# Altium project RCB_WiWi_STM32WL3.PrjPcb (part 1 of 2)
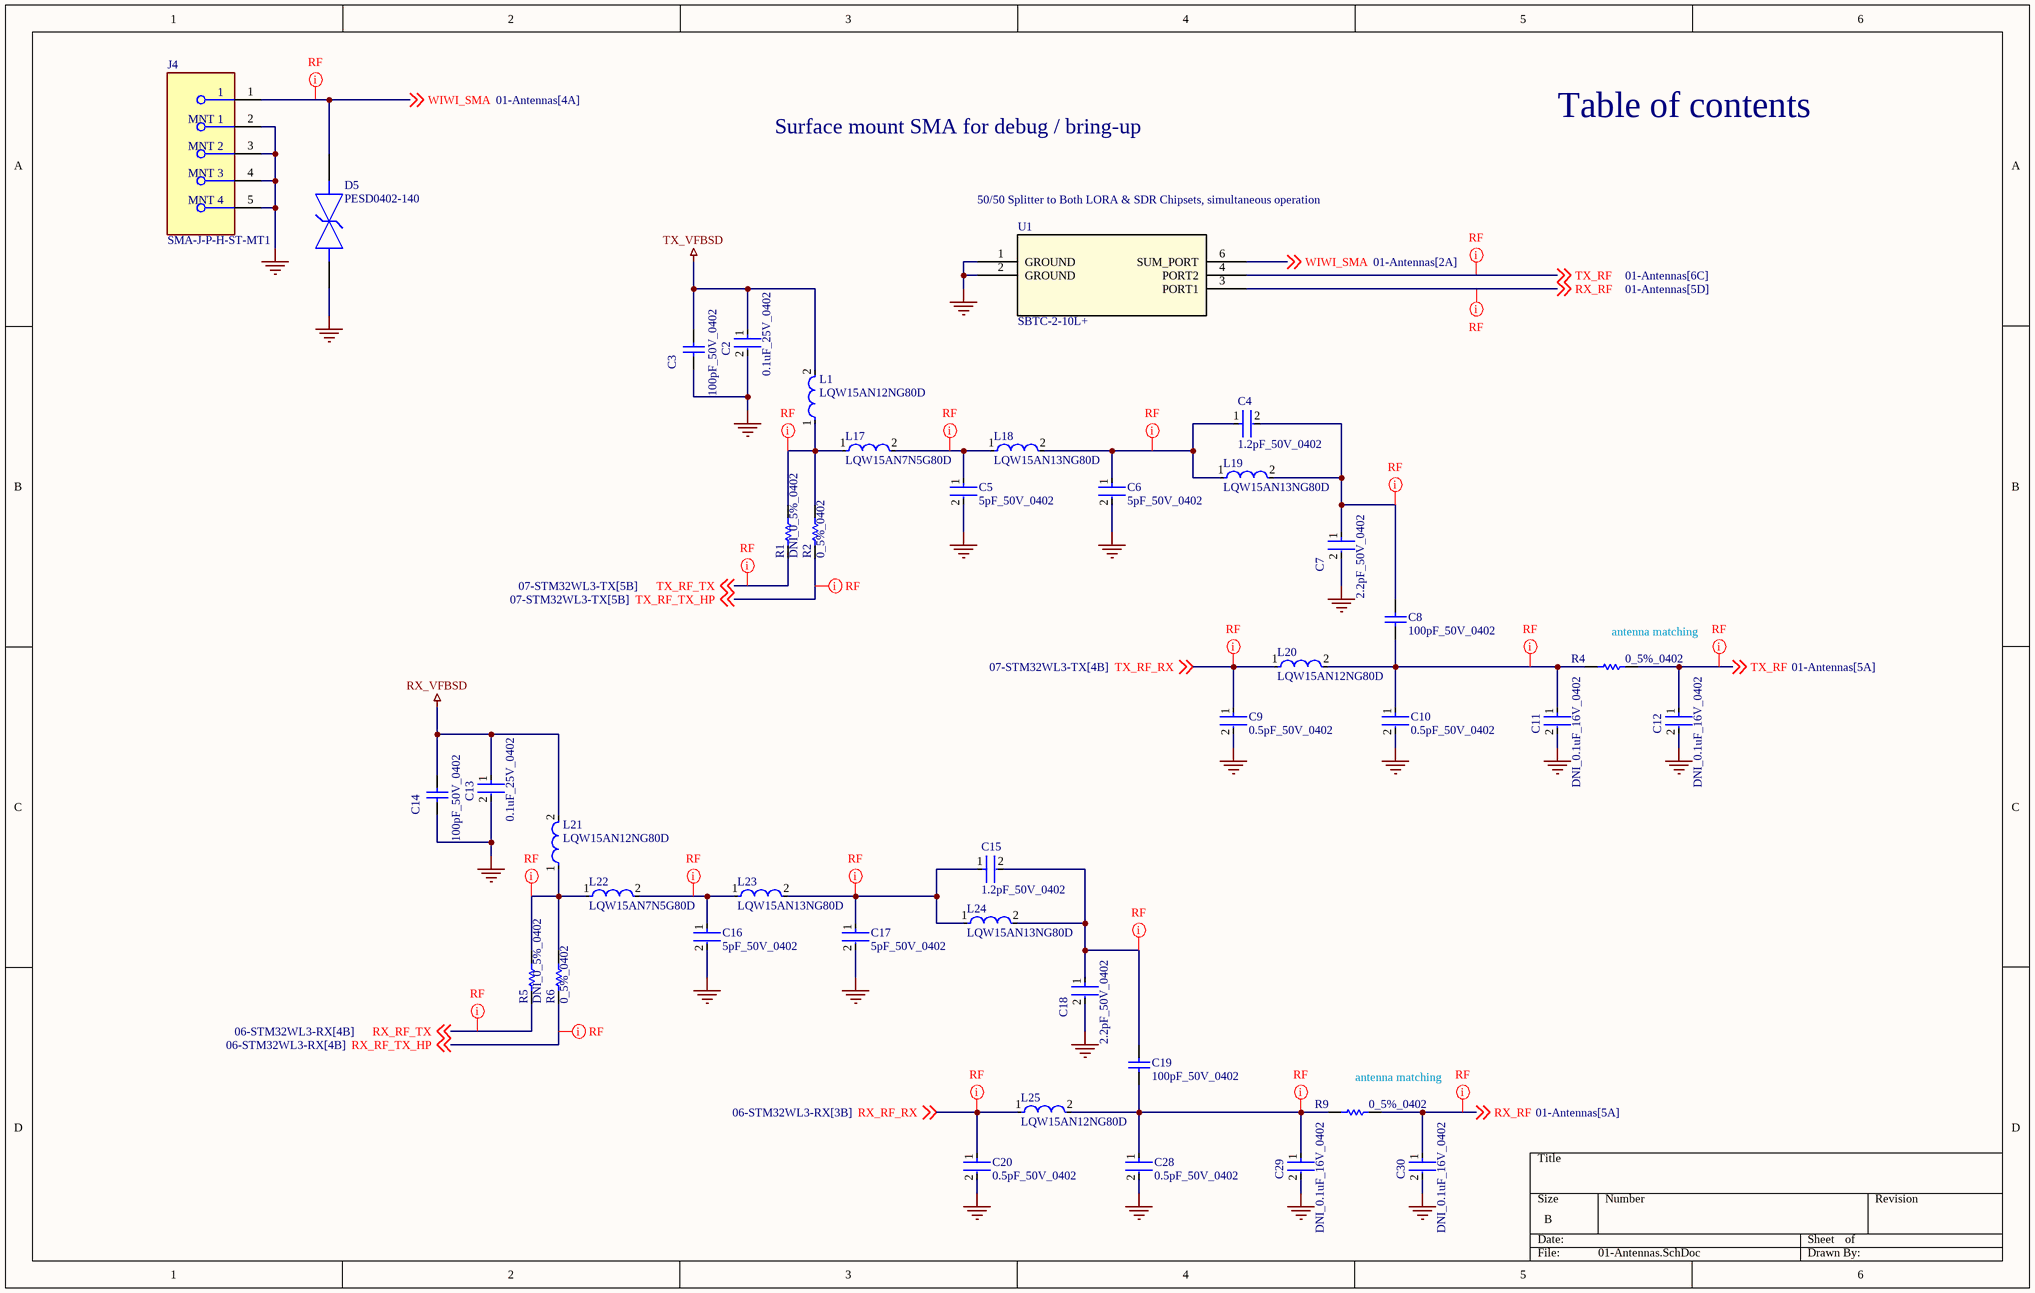
[diagram p0: 01-Antennas.SchDoc]
prjCompanyName: Meta Platforms Technologies, LLC.; prjContactAddress1: 9845 Willows Road NE; prjContactAddress2: Redmond, WA 98052; prjContactEmail: Contact Email; prjContactPhone: (...)-...-....; prjElectricalEngineer: Electical Engineer; prjElectricalEngineerEmail: Electical Engineer Email; prjLayoutEngineer: Layout Engineer; prjLayoutEngineerEmail: Layout Engineer Email; prjMechanicalEngineer: Mechanical Engineer; prjMechanicalEngineerEmail: Mechanical Engineer Email; prjPCB_IPN: 844-XXXXX-XX; prjPCB_Name: PCB Name; prjPCB_Revision: X1; prjProjectName: Project Name; prjSchematic_IPN: 846-XXXXX-XX; prjSchematic_Revision: X1; XprjPCBA_IPN: Set v_prjPCBA_IPN in variant parameters; XprjPCBA_Revision: Set v_prjPCBA_Revision in variant parameters
5 sheets, 223 parts. Net scope: global (net labels, ports and power ports of the same name join across sheets).
Board file: RCB_WiWi_STM32WL3_V1.PcbDoc
Sheets:
  01-Antennas.SchDoc
  02-8A34004_DPLL-1.SchDoc
  05-USB-Prog.SchDoc
  06-STM32WL3-RX.SchDoc
  07-STM32WL3-TX.SchDoc

## Sheet 01-Antennas.SchDoc
size B; SheetNumber: 1; SheetTotal: 8; SPICEModelCacheELOCFEDZ: <root> / <DocumentId>ELOCFEDZ</DocumentId> / </root>

### Parts
C2  0.1uF_25V_0402  [FP-0402-L_1_0_1-W_0_5_0_1-IPC_C]
C3  100pF_50V_0402  [CAPC1005X55X25ML05T10]
C4  1.2pF_50V_0402  [FP-GJM155-0_05-IPC_A]
C5  5pF_50V_0402  [FP-GJM155-0_05-IPC_B]
C6  5pF_50V_0402  [FP-GJM155-0_05-IPC_B]
C7  2.2pF_50V_0402  [FP-GJM155-0_05-IPC_C]
C8  100pF_50V_0402  [CAPC1005X55X25ML05T10]
C9  0.5pF_50V_0402  [FP-GJM155-0_05-MFG]
C10  0.5pF_50V_0402  [FP-GJM155-0_05-MFG]
C11  DNI_0.1uF_16V_0402  [FP-C0402-BB-MFG]  (no BOM)
C12  DNI_0.1uF_16V_0402  [FP-C0402-BB-MFG]  (no BOM)
C13  0.1uF_25V_0402  [FP-0402-L_1_0_1-W_0_5_0_1-IPC_C]
C14  100pF_50V_0402  [CAPC1005X55X25ML05T10]
C15  1.2pF_50V_0402  [FP-GJM155-0_05-IPC_A]
C16  5pF_50V_0402  [FP-GJM155-0_05-IPC_B]
C17  5pF_50V_0402  [FP-GJM155-0_05-IPC_B]
C18  2.2pF_50V_0402  [FP-GJM155-0_05-IPC_C]
C19  100pF_50V_0402  [CAPC1005X55X25ML05T10]
C20  0.5pF_50V_0402  [FP-GJM155-0_05-MFG]
C28  0.5pF_50V_0402  [FP-GJM155-0_05-MFG]
C29  DNI_0.1uF_16V_0402  [FP-C0402-BB-MFG]  (no BOM)
C30  DNI_0.1uF_16V_0402  [FP-C0402-BB-MFG]  (no BOM)
D5  PESD0402-140  [FP-PESD0402-MFG]
J4  SMA-J-P-H-ST-MT1  [FP-SMA-J-P-H-ST-MT1-MFG]
L1  LQW15AN12NG80D  [FP-LQW15AN_80-MFG]
L17  LQW15AN7N5G80D  [FP-LQW15AN_80-MFG]
L18  LQW15AN13NG80D  [FP-LQW15AN_80-MFG]
L19  LQW15AN13NG80D  [FP-LQW15AN_80-MFG]
L20  LQW15AN12NG80D  [FP-LQW15AN_80-MFG]
L21  LQW15AN12NG80D  [FP-LQW15AN_80-MFG]
L22  LQW15AN7N5G80D  [FP-LQW15AN_80-MFG]
L23  LQW15AN13NG80D  [FP-LQW15AN_80-MFG]
L24  LQW15AN13NG80D  [FP-LQW15AN_80-MFG]
L25  LQW15AN12NG80D  [FP-LQW15AN_80-MFG]
R1  DNI_0_5%_0402  [RESC1005X40X25NL05T10]  (no BOM)
R2  0_5%_0402  [RESC1005X40X25NL05T10]
R4  0_5%_0402  [RESC1005X40X25NL05T10]
R5  DNI_0_5%_0402  [RESC1005X40X25NL05T10]  (no BOM)
R6  0_5%_0402  [RESC1005X40X25NL05T10]
R9  0_5%_0402  [RESC1005X40X25NL05T10]
U1  SBTC-2-10L+  [AT1029_MNC]

### Nets
GND: C2.2 C3.1 C5.2 C6.2 C7.2 C9.2 C10.2 C11.2 C12.2 C13.2 C14.1 C16.2 C17.2 C18.2 C20.2 C28.2 C29.2 C30.2 D5.1 J4.2(MNT_1) J4.3(MNT_2) J4.4(MNT_3) J4.5(MNT_4) U1.1(GROUND) U1.2(GROUND)
RX_VFBSD: C13.1 C14.2 L21.2
TX_VFBSD: C2.1 C3.2 L1.2
RX_RF: C30.1 R9.2 U1.3(PORT1) ; off-sheet RX_RF
RX_RF_RX: C20.1 L25.1 ; off-sheet RX_RF_RX
RX_RF_TX: R5.1 ; off-sheet RX_RF_TX
RX_RF_TX_HP: R6.1 ; off-sheet RX_RF_TX_HP
TX_RF: C12.1 R4.2 U1.4(PORT2) ; off-sheet TX_RF
TX_RF_RX: C9.1 L20.1 ; off-sheet TX_RF_RX
TX_RF_TX: R1.1 ; off-sheet TX_RF_TX
TX_RF_TX_HP: R2.1 ; off-sheet TX_RF_TX_HP
WIWI_SMA: D5.2 J4.1 U1.6(SUM_PORT) ; off-sheet WIWI_SMA
NetC4_1: C4.1 C6.1 L18.2 L19.1
NetC4_2: C4.2 C7.1 C8.2 L19.2
NetC5_1: C5.1 L17.2 L18.1
NetC8_1: C8.1 C10.1 C11.1 L20.2 R4.1
NetC15_1: C15.1 C17.1 L23.2 L24.1
NetC15_2: C15.2 C18.1 C19.2 L24.2
NetC16_1: C16.1 L22.2 L23.1
NetC19_1: C19.1 C28.1 C29.1 L25.2 R9.1
NetL1_1: L1.1 L17.1 R1.2 R2.2
NetL21_1: L21.1 L22.1 R5.2 R6.2

### Layout directives
net class RF: NetC4_1, NetC4_2, NetC5_1, NetC8_1, NetC15_1, NetC15_2, NetC16_1, NetC19_1, NetL1_1, NetL21_1, RX_RF, RX_RF_RX, RX_RF_TX, RX_RF_TX_HP, TX_RF, TX_RF_RX, TX_RF_TX, TX_RF_TX_HP, WIWI_SMA

### Notes on the sheet
- Surface mount SMA for debug / bring-up
- Table of contents
- 50/50 Splitter to Both LORA & SDR Chipsets, simultaneous operation
- (near R4) antenna matching
- (near R9) antenna matching

### Library data of the parts
C2 C13 = CMP-2008-02519-2: General Purpose Ceramic Capacitor, 0402, 100nF, 10%, X7R, 15%, 25V; Package Quantity: 1; Capacitance: 100nF; Min Operating Temperature: -55°C; Voltage: 25V; Voltage Rating: 25V; Construction: Flat; Max Operating Temperature: 125°C; Radiation Hardening: No; Depth: 0.5mm; Thickness: 0.022inch; Voltage Rating (DC): 25V; Number of Pins: 2; Lead Free: Lead Free; Series: -; REACH SVHC: No SVHC; Length: 1mm; Dielectric: X7R; RoHS Compliant: Yes; Mount: Surface Mount; Packaging: Tape and Reel; Case/Package: 0402; Case Code (Imperial): 0402; Termination: SMD/SMT; Width: 0.02inch; Case Code (Metric): 1005; Tolerance: 10%
C3 C8 C14 C19 = CMP-2008-03915-1: Manufacturer: Murata; Part Number: GRM1555C1H101JA01D
C4 C15 = CMP-2008-03815-2: Multi-Layer Ceramic Capacitor 1.2pF C0G  ±0.05pF 0402 Paper T/R; Voltage Rating: 50V; Min Operating Temperature: -55°C; Length: 1mm; Package Quantity: 10000; Depth: 0.5mm; Radiation Hardening: No; Case/Package: 0402; Mount: Surface Mount; Dielectric: C0G; Case Code (Metric): 1005; Case Code (Imperial): 0402; Height: 0.5mm; Packaging: Tape and Reel; Width: 0.02inch; Voltage Rating (DC): 50V; Capacitance: 1.2pF; Lead Free: Lead Free; Termination: SMD/SMT; Voltage: 50V; Max Operating Temperature: 125°C; Thickness: 0.022inch
C5 C6 C16 C17 = CMP-06035-005630-1: Multi-Layer Ceramic Capacitor 5pF C0G  ±0.05pF 0402 Paper T/R; Voltage Rating (DC): 50V; Capacitance: 5pF; Case Code (Metric): 1005; Radiation Hardening: No; Package Quantity: 10000; Case Code (Imperial): 0402; Termination: SMD/SMT; Min Operating Temperature: -55°C; Depth: 0.5mm; Packaging: Tape and Reel; Length: 1mm; Dielectric: C0G; Width: 0.5mm; Height: 0.5mm; Case/Package: 0402; Thickness: 0.022inch; Max Operating Temperature: 125°C; Voltage Rating: 50V; Mount: Surface Mount
C7 C18 = CMP-2008-03837-2: Multi-Layer Ceramic Capacitor 2.2pF C0G  ±0.05pF 0402 Paper T/R; Voltage Rating: 50V; Case/Package: 0402; Termination: SMD/SMT; Package Quantity: 10000; Construction: Flat; Width: 0.02inch; Length: 0.039inch; Dielectric: C0G; Mount: Surface Mount; Radiation Hardening: No; Case Code (Imperial): 0402; Depth: 0.5mm; Case Code (Metric): 1005; Packaging: Tape and Reel; Height: 0.5mm; Series: GJM; Thickness: 0.022inch; Max Operating Temperature: 125°C; Lead Free: Lead Free; Min Operating Temperature: -55°C; Voltage Rating (DC): 50V; Capacitance: 2.2pF
C9 C10 C20 C28 = CMP-2008-03904-2: Multi-Layer Ceramic Capacitor 0.5pF C0G  ±0.1pF 0402 Paper T/R; Voltage Rating (DC): 50V; Temperature Coefficient: 30ppm/°C; Lead Pitch: 0.3mm; Max Operating Temperature: 125°C; Thickness: 0.022inch; Termination: SMD/SMT; Depth: 0.5mm; Height: 0.5mm; Voltage Rating: 50V; Length: 1mm; Case/Package: 0402; Radiation Hardening: No; Min Operating Temperature: -55°C; Width: 0.02inch; Voltage: 50V; Number of Pins: 2; REACH SVHC: No SVHC; Case Code (Imperial): 0402; Package Quantity: 1; Mount: Surface Mount; Capacitance: 0.5pF; Dielectric: C0G; Lead Free: Lead Free; Case Code (Metric): 1005; Packaging: Tape and Reel
C11 C12 C29 C30 = CMP-1034-02068-3: CAP CER 0.1UF 16V 5% X7R 0402; Manufacturer: Kemet; Manufacturer Part Number: C0402C104J4RACTU; Value: 0.10 μF; Temperature Coefficient: 15%; Tolerance: 0.05; Material: Ceramic; ComponentLink2URL: https://content.kemet.com/datasheets/KEM_C1002_X7R_SMD.pdf; Automotive: No; Device Class L2: Capacitors; Temperature: -55°C to +125°C; RoHS: TRUE; Voltage Rating: 16 V; ComponentLink2Description: Datasheet; Device Class L3: Ceramic Capacitors; Temperature Range Low: -55°C; Ipc Land Pattern Name: CAPC10050X50; Device Class L1: Passive Components; Temperature Range High: +125°C; Package: C0402-BB; Capacitance: 0.10 μF; Category: Cap; Mouser Description: CAP CER 0.1UF 16V X7R 0402; Height: 0.55mm; Digikey Description: CAP CER 0.1UF 16V 5% X7R 0402; Octopart: https://octopart.com/c0402c104j4ractu-kemet-12573893; Temperature Characteristic: X7R; Lead Free: Yes
D5 = CMP-08607-000011-1: TVS DIODE 14V 40V 0402; Manufacturer: Littelfuse Inc.; Automotive Grade: Grade 1; Capacitance: 0.25pF; Value: 0.25pF; Direction: Bidirectional; Number Of Channels: 1; Temperature Range Low: -55°C; Lead Free: Yes; Temperature: -55°C to +125°C; Digikey Description: TVS DIODE 14V 40V 0402; Automotive: Yes; Device Class L2: TVS Diodes; Reverse Standoff Voltage: 14V; Device Class L1: Circuit Protection; Ipc Land Pattern Name: DIOC10050X33; Manufacturer Part Number: PESD0402-140; Breakdown Voltage: 14V; Height: 0.43mm; Clamping Voltage: 40V; RoHS: TRUE; Temperature Range High: +125°C; Device Class L3: unset; Octopart: https://octopart.com/pesd0402-140-littelfuse-74215061; Package: PESD0402; ComponentLink2URL: https://www.littelfuse.com/~/media/electronics/datasheets/polymer_esd_suppressors/littelfuse_polymer_esd_suppressor_pesd_catalog_datasheet.pdf.pdf; Category: Diode; ComponentLink2Description: Datasheet
J4 = CMP-02754-000007-1: CONN SMA JACK STR 50 OHM SMD; Dielectric Material: PTFE; Voltage Rating: 335V; Body Material: Brass; Center Contact Plating: Gold; Impedance: 50R; Number of Ports: 1; Max Frequency: 20GHz; Mount: Surface Mount; Contact Plating: Gold; Housing Color: Gold; Series: -; Fastening Type: Threaded; Packaging: Bulk; Connector Type: SMA; Contact Material: Copper Alloy; Body Plating: Gold; Case/Package: SMA; Termination: Solder; RoHS Compliant: No; Min Operating Temperature: -65°C; Max Operating Temperature: 125°C
L1 L20 L21 L25 = CMP-06042-001817-1: Wire Wound RF Inductor 12nH ±2% 1240mA 0.093Ω 0402 (1005); Test Frequency: 100MHz; DC Resistance (DCR): 93mR; Self Resonant Frequency: 5.2GHz; Shielding: Unshielded; Max DC Current: 1.24A; Q Factor: 30; Core Material: Ferrite; Package Quantity: 10000; Case Code (Imperial): 0402; Inductance: 12nH; Packaging: Tape and Reel; Min Operating Temperature: -55°C; Mount: Surface Mount; Length: 0.039inch; Height: 0.5mm; Max Operating Temperature: 125°C; Case Code (Metric): 1005; Resistor Type: Wirewound; Height - Seated (Max): 0.024inch; Termination: SMD/SMT; Tolerance: 2%; Current Rating: 1.24A; Width: 0.024inch; Case/Package: 0402
L17 L22 = CMP-06042-000856-1: Wire Wound RF Inductor 7.5nH ±2% 1700mA 0.05Ω 0402 (1005); Max DC Current: 1.7A; Shielding: Unshielded; Core Material: Ferrite; Self Resonant Frequency: 7GHz; DC Resistance (DCR): 50mR; Test Frequency: 100MHz; Q Factor: 35; Inductance: 7.5nH; Mount: Surface Mount; Length: 0.039inch; Width: 0.024inch; Case Code (Metric): 0402; Min Operating Temperature: -55°C; Current Rating: 1.7A; Package Quantity: 10000; Tolerance: 2%; Height: 0.5mm; Case/Package: 0402; Height - Seated (Max): 0.024inch; Max Operating Temperature: 125°C; Termination: SMD/SMT; Case Code (Imperial): 1005; Resistor Type: Wirewound; Packaging: Tape and Reel
L18 L19 L23 L24 = CMP-06042-008137-1: Wire Wound RF Inductor 13nH ±2% 1240mA 0.093Ω 0402 (1005); Core Material: Ferrite; Q Factor: 30; DC Resistance (DCR): 93mR; Current Rating: 1.24A; Shielding: Unshielded; Test Frequency: 100MHz; Self Resonant Frequency: 5.2GHz; Case Code (Imperial): 0402; Max Operating Temperature: 125°C; Height: 0.5mm; Case Code (Metric): 1005; Packaging: Tape and Reel; Package Quantity: 10000; Mount: Surface Mount; Tolerance: 2%; Case/Package: 0402; Resistor Type: Wirewound; Min Operating Temperature: -55°C; Length: 0.039inch; Termination: SMD/SMT; Max DC Current: 1.24A; Inductance: 13nH; Width: 0.024inch; Height - Seated (Max): 0.024inch
R1 R2 R4-R6 R9 = CMP-2002-06457-1: Manufacturer: Panasonic; Part Number: ERJ-U020R00X
U1 = SBTC-2-10L+: No Description Available; Mfr_Name: Mini Circuits; Copyright: Copyright (C) 2023 Ultra Librarian. All rights reserved.; Manufacturer_Part_Number: SBTC-2-10L+; RefDes: RefDes; Type: DEV

## Sheet 02-8A34004_DPLL-1.SchDoc
size B; SheetNumber: 2; SheetTotal: 8
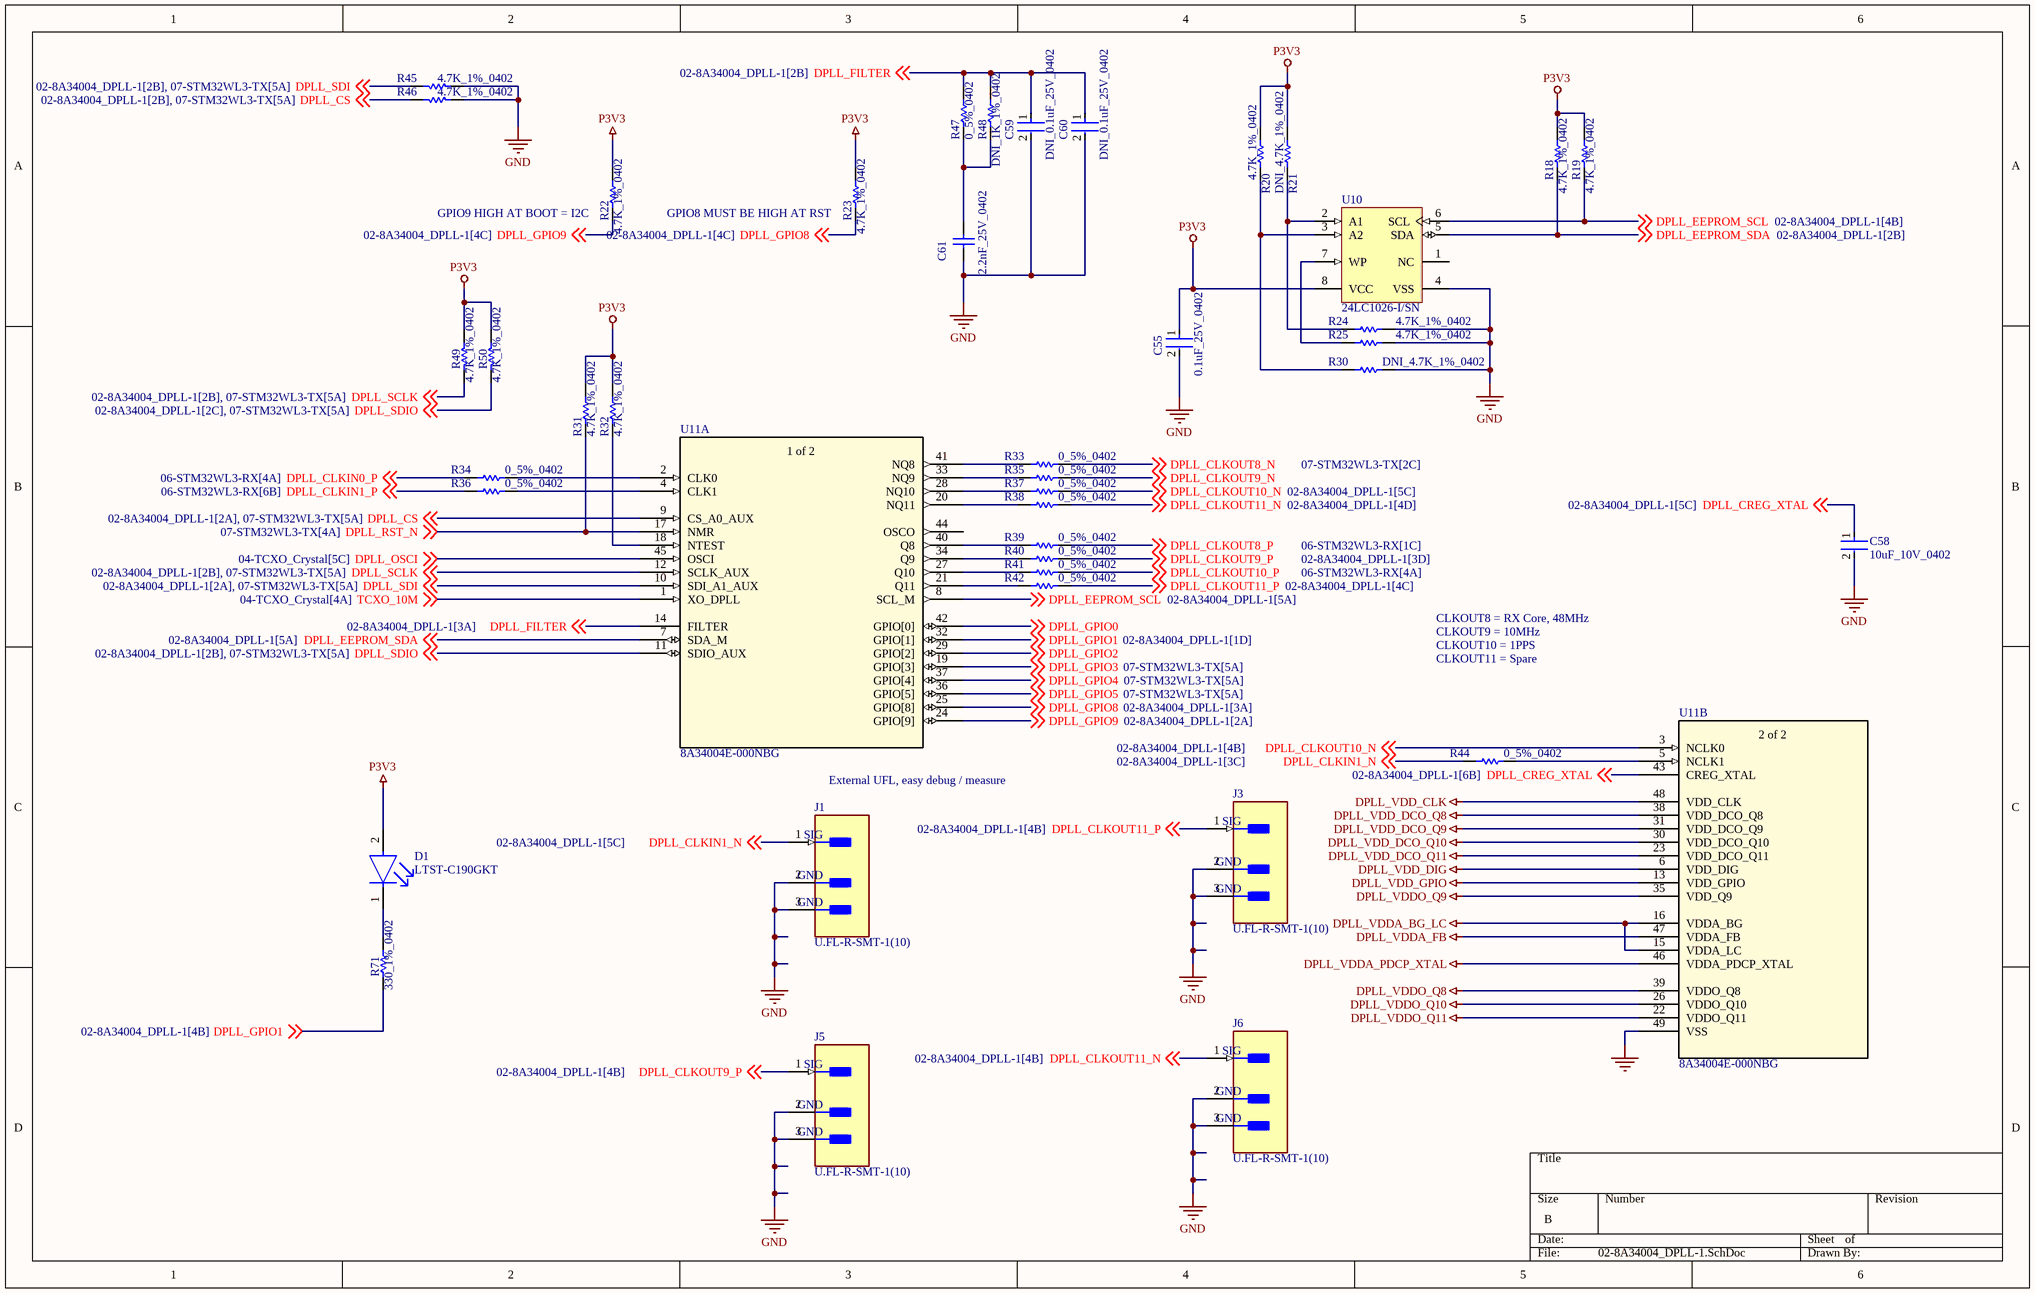
[diagram p1: 02-8A34004_DPLL-1.SchDoc]

### Parts
C55  0.1uF_25V_0402  [FP-0402-L_1_0_1-W_0_5_0_1-IPC_C]
C58  10uF_10V_0402  [FP-CL05A106MP5NUNC-MFG]
C59  DNI_0.1uF_25V_0402  [FP-0402-L_1_0_1-W_0_5_0_1-IPC_C]  (no BOM)
C60  DNI_0.1uF_25V_0402  [FP-0402-L_1_0_1-W_0_5_0_1-IPC_C]  (no BOM)
C61  2.2nF_25V_0402  [CAPC1005X56X25LL10T15]
D1  LTST-C190GKT  [FP-LTST-C190GKT-MFG]
J1  U.FL-R-SMT-1(10)  [FP-U_FL-R-SMT-1_10-MFG]
J3  U.FL-R-SMT-1(10)  [FP-U_FL-R-SMT-1_10-MFG]
J5  U.FL-R-SMT-1(10)  [FP-U_FL-R-SMT-1_10-MFG]
J6  U.FL-R-SMT-1(10)  [FP-U_FL-R-SMT-1_10-MFG]
R18  4.7K_1%_0402  [RESC1005X40X25NL10T10]
R19  4.7K_1%_0402  [RESC1005X40X25NL10T10]
R20  4.7K_1%_0402  [RESC1005X40X25NL10T10]
R21  DNI_4.7K_1%_0402  [RESC1005X40X25NL10T10]  (no BOM)
R22  4.7K_1%_0402  [RESC1005X40X25NL10T10]
R23  4.7K_1%_0402  [RESC1005X40X25NL10T10]
R24  4.7K_1%_0402  [RESC1005X40X25NL10T10]
R25  4.7K_1%_0402  [RESC1005X40X25NL10T10]
R30  DNI_4.7K_1%_0402  [RESC1005X40X25NL10T10]  (no BOM)
R31  4.7K_1%_0402  [RESC1005X40X25NL10T10]
R32  4.7K_1%_0402  [RESC1005X40X25NL10T10]
R33  0_5%_0402  [RESC1005X40X25NL05T10]
R34  0_5%_0402  [RESC1005X40X25NL05T10]
R35  0_5%_0402  [RESC1005X40X25NL05T10]
R36  0_5%_0402  [RESC1005X40X25NL05T10]
R37  0_5%_0402  [RESC1005X40X25NL05T10]
R38  0_5%_0402  [RESC1005X40X25NL05T10]
R39  0_5%_0402  [RESC1005X40X25NL05T10]
R40  0_5%_0402  [RESC1005X40X25NL05T10]
R41  0_5%_0402  [RESC1005X40X25NL05T10]
R42  0_5%_0402  [RESC1005X40X25NL05T10]
R44  0_5%_0402  [RESC1005X40X25NL05T10]
R45  4.7K_1%_0402  [RESC1005X40X25NL10T10]
R46  4.7K_1%_0402  [RESC1005X40X25NL10T10]
R47  0_5%_0402  [RESC1005X40X25LL10T10]
R48  DNI_1K_1%_0402  [RESC1005X40X25NL05T05]  (no BOM)
R49  4.7K_1%_0402  [RESC1005X40X25NL10T10]
R50  4.7K_1%_0402  [RESC1005X40X25NL10T10]
R71  330_1%_0402  [RESC1005X40X25NL10T10]
U10  24LC1026-I/SN  [MCHP-SOIC-SN8_N]
U11  8A34004E-000NBG  [NBG48P1_REN]  (parts A,B of 2)

### Nets
DPLL_VDD_CLK: U11.48(VDD_CLK)
DPLL_VDD_DCO_Q8: U11.38(VDD_DCO_Q8)
DPLL_VDD_DCO_Q9: U11.31(VDD_DCO_Q9)
DPLL_VDD_DCO_Q10: U11.30(VDD_DCO_Q10)
DPLL_VDD_DCO_Q11: U11.23(VDD_DCO_Q11)
DPLL_VDD_DIG: U11.6(VDD_DIG)
DPLL_VDD_GPIO: U11.13(VDD_GPIO)
DPLL_VDDA_BG_LC: U11.15(VDDA_LC) U11.16(VDDA_BG)
DPLL_VDDA_FB: U11.47(VDDA_FB)
DPLL_VDDA_PDCP_XTAL: U11.46(VDDA_PDCP_XTAL)
DPLL_VDDO_Q8: U11.39(VDDO_Q8)
DPLL_VDDO_Q9: U11.35(VDD_Q9)
DPLL_VDDO_Q10: U11.26(VDDO_Q10)
DPLL_VDDO_Q11: U11.22(VDDO_Q11)
GND: C55.2 C58.2 C59.2 C60.2 C61.1 J1.2(GND) J1.3(GND) J3.2(GND) J3.3(GND) J5.2(GND) J5.3(GND) J6.2(GND) J6.3(GND) R24.1 R25.1 R30.2 R45.2 R46.2 U10.4(VSS) U11.49(VSS)
P3V3: C55.1 D1.2(A) R18.1 R19.1 R20.2 R21.2 R22.1 R23.1 R31.2 R32.2 R49.2 R50.2 U10.8(VCC)
DPLL_CLKIN0_P: R34.1 ; off-sheet DPLL_CLKIN0_P
DPLL_CLKIN1_N: J1.1(SIG) R44.1 ; off-sheet DPLL_CLKIN1_N
DPLL_CLKIN1_P: R36.1 ; off-sheet DPLL_CLKIN1_P
DPLL_CLKOUT8_N: R33.2 ; off-sheet DPLL_CLKOUT8_N
DPLL_CLKOUT8_P: R39.2 ; off-sheet DPLL_CLKOUT8_P
DPLL_CLKOUT9_N: R35.2 ; off-sheet DPLL_CLKOUT9_N
DPLL_CLKOUT9_P: J5.1(SIG) R40.2 ; off-sheet DPLL_CLKOUT9_P
DPLL_CLKOUT10_N: R37.2 U11.3(NCLK0) ; off-sheet DPLL_CLKOUT10_N
DPLL_CLKOUT10_P: R41.2 ; off-sheet DPLL_CLKOUT10_P
DPLL_CLKOUT11_N: J6.1(SIG) R38.2 ; off-sheet DPLL_CLKOUT11_N
DPLL_CLKOUT11_P: J3.1(SIG) R42.2 ; off-sheet DPLL_CLKOUT11_P
DPLL_CREG_XTAL: C58.1 U11.43(CREG_XTAL) ; off-sheet DPLL_CREG_XTAL
DPLL_CS: R46.1 U11.9(CS_A0_AUX) ; off-sheet DPLL_CS
DPLL_EEPROM_SCL: R19.2 U10.6(SCL) U11.8(SCL_M) ; off-sheet DPLL_EEPROM_SCL
DPLL_EEPROM_SDA: R18.2 U10.5(SDA) U11.7(SDA_M) ; off-sheet DPLL_EEPROM_SDA
DPLL_FILTER: C59.1 C60.1 R47.2 R48.2 U11.14(FILTER) ; off-sheet DPLL_FILTER
DPLL_GPIO0: U11.42(GPIO[0]) ; off-sheet DPLL_GPIO0
DPLL_GPIO1: R71.1 U11.32(GPIO[1]) ; off-sheet DPLL_GPIO1
DPLL_GPIO2: U11.29(GPIO[2]) ; off-sheet DPLL_GPIO2
DPLL_GPIO3: U11.19(GPIO[3]) ; off-sheet DPLL_GPIO3
DPLL_GPIO4: U11.37(GPIO[4]) ; off-sheet DPLL_GPIO4
DPLL_GPIO5: U11.36(GPIO[5]) ; off-sheet DPLL_GPIO5
DPLL_GPIO8: R23.2 U11.25(GPIO[8]) ; off-sheet DPLL_GPIO8
DPLL_GPIO9: R22.2 U11.24(GPIO[9]) ; off-sheet DPLL_GPIO9
DPLL_OSCI: U11.45(OSCI) ; off-sheet DPLL_OSCI
DPLL_RST_N: R31.1 U11.17(NMR) ; off-sheet DPLL_RST_N
DPLL_SCLK: R49.1 U11.12(SCLK_AUX) ; off-sheet DPLL_SCLK
DPLL_SDI: R45.1 U11.10(SDI_A1_AUX) ; off-sheet DPLL_SDI
DPLL_SDIO: R50.1 U11.11(SDIO_AUX) ; off-sheet DPLL_SDIO
TCXO_10M: U11.1(XO_DPLL) ; off-sheet TCXO_10M
NetC61_2: C61.2 R47.1 R48.1
NetD1_1: D1.1(C) R71.2
NetR20_1: R20.1 R30.1 U10.3(A2)
NetR21_1: R21.1 R24.2 U10.2(A1)
NetR25_2: R25.2 U10.7(WP)
NetR32_1: R32.1 U11.18(NTEST)
NetR33_1: R33.1 U11.41(NQ8)
NetR34_2: R34.2 U11.2(CLK0)
NetR35_1: R35.1 U11.33(NQ9)
NetR36_2: R36.2 U11.4(CLK1)
NetR37_1: R37.1 U11.28(NQ10)
NetR38_1: R38.1 U11.20(NQ11)
NetR39_1: R39.1 U11.40(Q8)
NetR40_1: R40.1 U11.34(Q9)
NetR41_1: R41.1 U11.27(Q10)
NetR42_1: R42.1 U11.21(Q11)
NetR44_2: R44.2 U11.5(NCLK1)

Not connected (* = marked no-connect by the designer): U10 1(NC); U11 44(OSCO)

### Notes on the sheet
- (near R22) GPIO9 HIGH AT BOOT = I2C
- GPIO8 MUST BE HIGH AT RST
- CLKOUT8 = RX Core, 48MHz
- CLKOUT9 = 10MHz
- CLKOUT10 = 1PPS
- CLKOUT11 = Spare
- External UFL, easy debug / measure
- (in symbol 8A34004E-000NBG, part A) 1 of 2
- (in symbol 8A34004E-000NBG, part B) 2 of 2

### Library data of the parts
C55 C59 C60 = CMP-2008-02519-2: as C2 on sheet 01-Antennas; Package Quantity: 1; Capacitance: 100nF; Min Operating Temperature: -55°C; Voltage: 25V; Voltage Rating: 25V; Construction: Flat; Max Operating Temperature: 125°C; Radiation Hardening: No; Depth: 0.5mm; Thickness: 0.022inch; Voltage Rating (DC): 25V; Number of Pins: 2; Lead Free: Lead Free; Series: -; REACH SVHC: No SVHC; Length: 1mm; Dielectric: X7R; RoHS Compliant: Yes; Mount: Surface Mount; Packaging: Tape and Reel; Case/Package: 0402; Case Code (Imperial): 0402; Termination: SMD/SMT; Width: 0.02inch; Case Code (Metric): 1005; Tolerance: 10%
C58 = CMP-13271-000002-1: CAP CER 10UF 10V X5R 0402; Manufacturer Part Number: CL05A106MP5NUNC; Manufacturer: Samsung; Temperature Coefficient: 15%; Tolerance: 20%; Material: Ceramic; Octopart: https://octopart.com/cl05a106mp5nunc-samsung-22457395; Voltage Rating: 10V; RoHS: TRUE; Value: 10uF; Height: 0.7mm; Digikey Description: CAP CER 10UF 10V X5R 0402; Automotive: No; Package: CL05A106MP5NUNC; Device Class L1: Passive Components; Capacitance: 10uF; Temperature Range High: +85°C; ComponentLink2Description: Datasheet; Device Class L2: Capacitors; Temperature Characteristic: X5R; Temperature: -55°C to +85°C; ComponentLink2URL: http://www.samsungsem.com/kr/support/product-search/mlcc/__icsFiles/afieldfile/2019/05/10/19-CL05A106MP5NUNC.pdf; Device Class L3: Ceramic Capacitors; Category: Cap; Temperature Range Low: -55°C; Ipc Land Pattern Name: CAPC10050X50; Lead Free: Yes
C61 = CMP-2008-02907-1: Manufacturer: AVX Interconnect / Elco; Part Number: 04025C222JAT2A
D1 = CMP-22017-000005-2: LED GREEN CLEAR CHIP SMD; Dominant Wavelength: 569nm; Reverse Voltage: 5V; Lens Color: Colorless; Viewing Angle: 130°; Voltage: 2V; Forward Current: 30mA; Power Dissipation: 100mW; Luminous Intensity: 6mcd; Number of LEDs: 1; Forward Voltage: 2.1V; Wavelength: 565nm; Test Current: 10mA; Min Operating Temperature: -55°C; Lens Style: Clear; Mount: Surface Mount; Width: 0.8mm; Packaging: Tape and Reel; Lens Transparency: Clear; Case Code (Metric): 1608; Depth: 0.8mm; Case Code (Imperial): 0603; Case/Package: 0603; Number of Pins: 2; Max Operating Temperature: 85°C; Lead Free: Lead Free; Number of Elements: 1; Length: 1.6mm; Height: 0.8mm; Package Quantity: 1; Power Rating: 100mW; Radiation Hardening: No; Illumination Color: Green; Color: Green
J1 J3 J5 J6 = CMP-2000-05152-3: CONN U.FL RCPT STR 50 OHM SMD; Max Frequency: 6GHz; Connector Type: Coaxial; Body Plating: Silver; Body Material: Bronze; Impedance: 50R; Dielectric Material: Polymer; Insulation Resistance: 500MR; Gender: Male; Packaging: Cut Tape; Length: 3mm; Package Quantity: 2500; Termination: Solder; Lead Free: Lead Free; Series: U.FL; Min Operating Temperature: -40°C; Fastening Type: Snap; Contact Material: Brass; Orientation: Straight; Wire/Cable Type: Coaxial; Frequency: 6GHz; Contact Plating: Gold; Depth: 3.1mm; Weight: 0.001764oz; Max Operating Temperature: 90°C; Radiation Hardening: No; REACH SVHC: No SVHC; Mount: Surface Mount; Housing Color: Beige
R18-R25 R30-R32 R45 R46 R49 R50 = CMP-2002-05217-1: Manufacturer: Bourns; Part Number: CR0402-FX-4701GLF
R33-R42 R44 = CMP-2002-06457-1: as R1 on sheet 01-Antennas
R47 = CMP-2002-04569-1: Manufacturer: KOA Speer; Part Number: RK73Z1ETTP
R48 = CMP-2002-08277-1: Manufacturer: Vishay Dale; Part Number: CRCW04021K00FKTD
R71 = CMP-2002-05853-1: Manufacturer: Panasonic; Part Number: ERA-2AED331X
U10 = CMP-0159-01024-1: 1024K bits I2C™ Serial EEPROM, 2.5 to 5.5 V, 400 kHz, -40 to 85 degC, 8-pin SOIC (SN8), Tube; Manufacturer: Microchip; DatasheetVersion: Rev. C; ComponentLink3Description: Package Specification; ComponentLink1URL: http://www.microchip.com; Mounting Technology: Surface Mount; ComponentLink4URL: http://www.microchip.com/24LC1026; ComponentLink2Description: Datasheet; PartNumber: 24LC1026-I/SN; PackageReference: SOIC-SN8; PackageDescription: 8-Lead Plastic Small Outline, 4.9 x 3.9 mm Body, 1.27 mm Pitch; ComponentLink1Description: Manufacturer URL; ComponentLink3URL: http://www.microchip.com/stellent/groups/techpub_sg/documents/packagingspec/en012702.pdf; ComponentLink2URL: http://ww1.microchip.com/downloads/en/DeviceDoc/22270C.pdf; PackageVersion: C04-057C; ComponentLink4Description: Product URL
U11 = 8A34004E-000NBG: No Description Available; Mfr_Name: Renesas Electronics; RefDes: RefDes; Type: Type

## Sheet 05-USB-Prog.SchDoc
size B; SheetNumber: 5; SheetTotal: 8
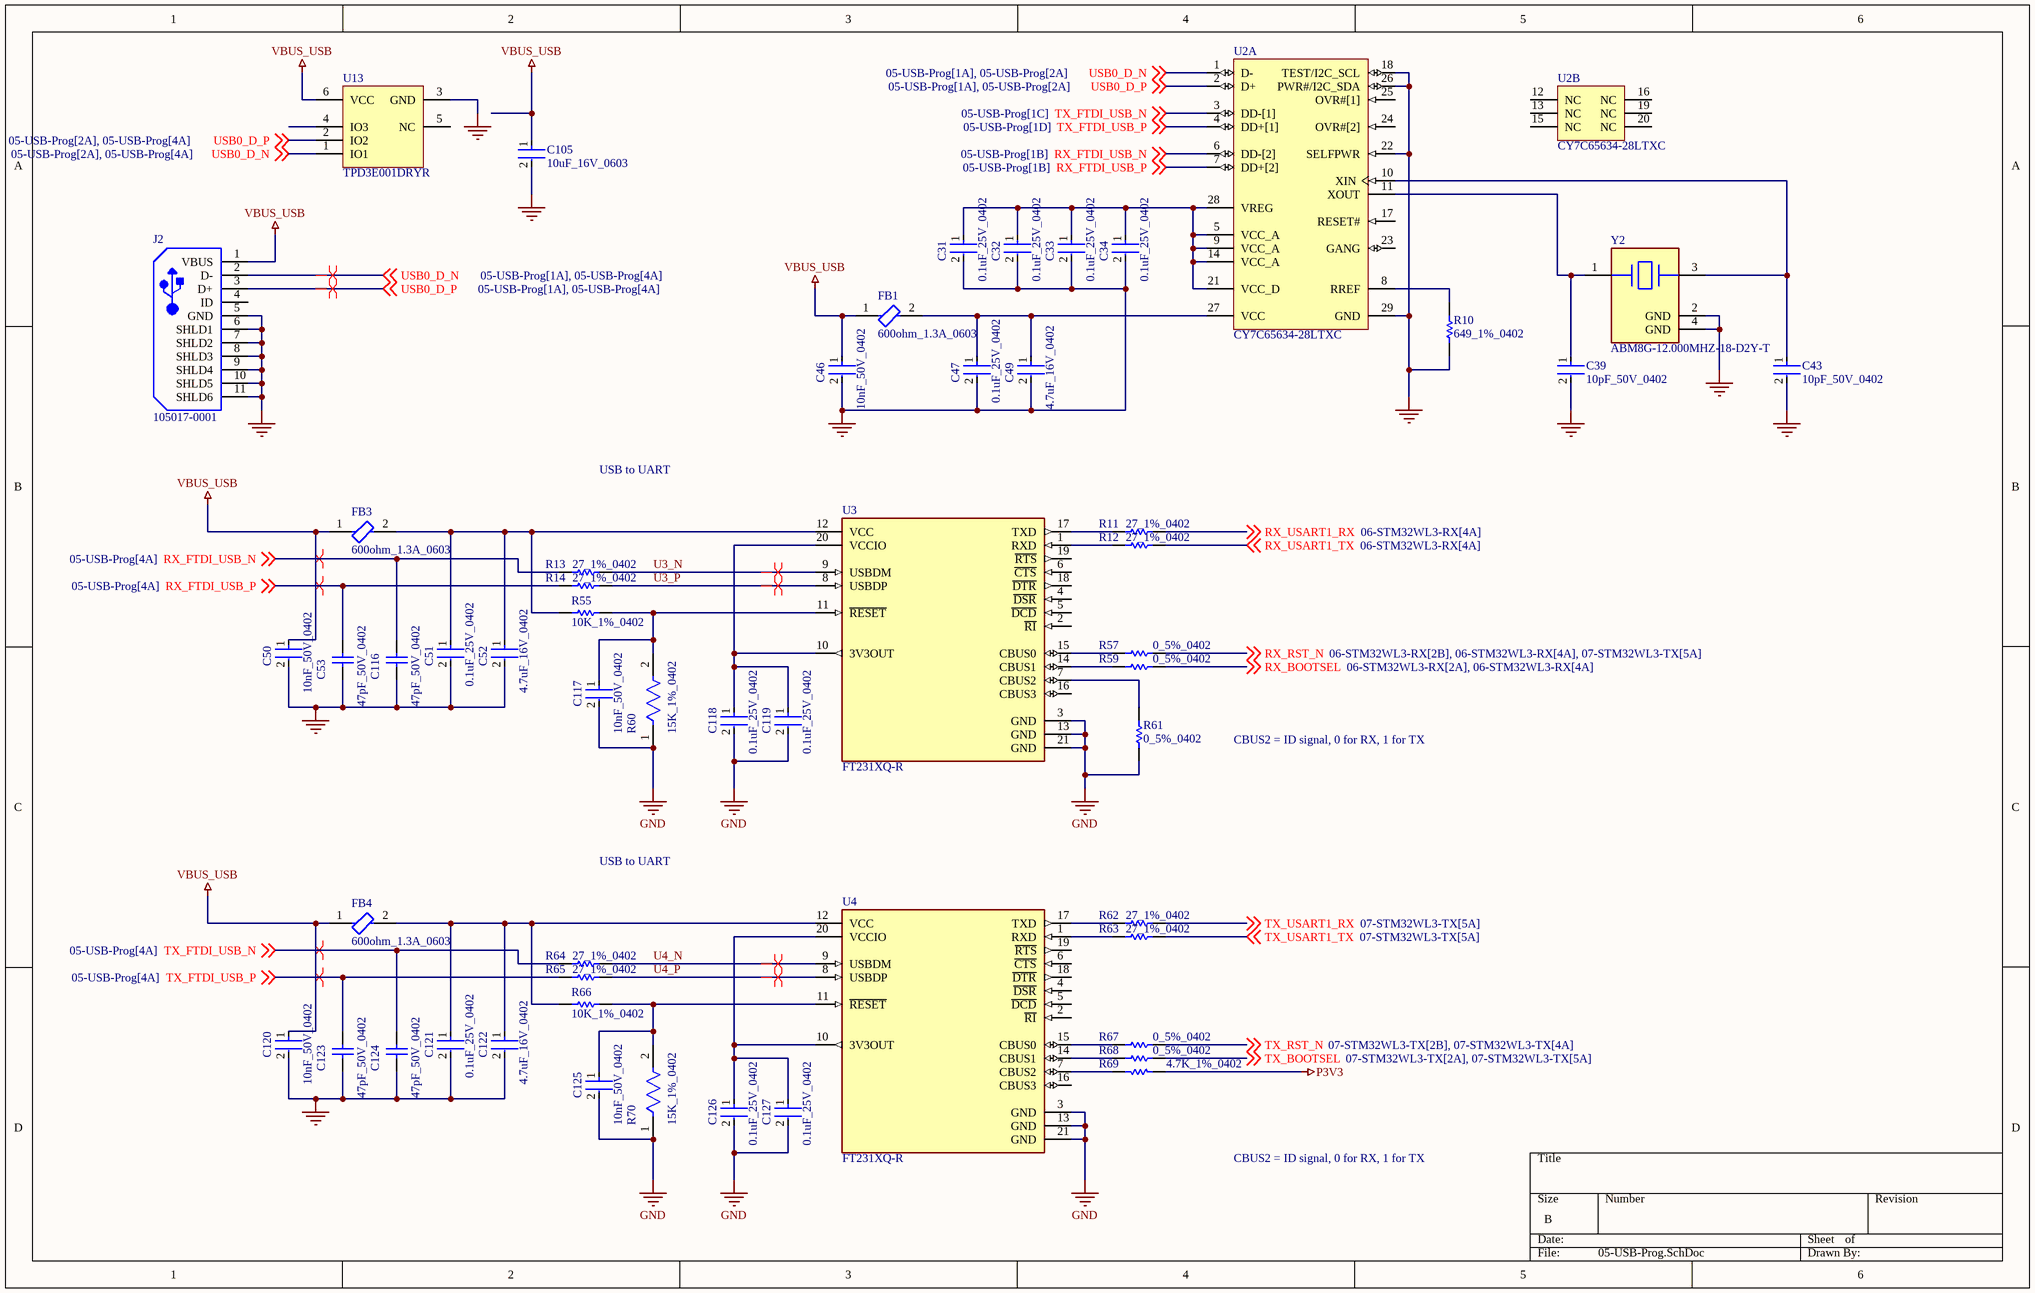
[diagram p2: 05-USB-Prog.SchDoc]

### Parts
C31  0.1uF_25V_0402  [FP-0402-L_1_0_1-W_0_5_0_1-IPC_C]
C32  0.1uF_25V_0402  [FP-0402-L_1_0_1-W_0_5_0_1-IPC_C]
C33  0.1uF_25V_0402  [FP-0402-L_1_0_1-W_0_5_0_1-IPC_C]
C34  0.1uF_25V_0402  [FP-0402-L_1_0_1-W_0_5_0_1-IPC_C]
C39  10pF_50V_0402  [FP-C1005-050-0_05-IPC_C]
C43  10pF_50V_0402  [FP-C1005-050-0_05-IPC_C]
C46  10nF_50V_0402  [FP-CC0402-MFG]
C47  0.1uF_25V_0402  [FP-0402-L_1_0_1-W_0_5_0_1-IPC_C]
C49  4.7uF_16V_0402  [FP-CL829-IPC_C]
C50  10nF_50V_0402  [FP-CC0402-MFG]
C51  0.1uF_25V_0402  [FP-0402-L_1_0_1-W_0_5_0_1-IPC_C]
C52  4.7uF_16V_0402  [FP-CL829-IPC_C]
C53  47pF_50V_0402  [CAPC1005X55X25LL05T10]
C105  10uF_16V_0603  [FP-0603-L_1_6_0_2-W_0_8_0-MFG]
C116  47pF_50V_0402  [CAPC1005X55X25LL05T10]
C117  10nF_50V_0402  [FP-CC0402-MFG]
C118  0.1uF_25V_0402  [FP-0402-L_1_0_1-W_0_5_0_1-IPC_C]
C119  0.1uF_25V_0402  [FP-0402-L_1_0_1-W_0_5_0_1-IPC_C]
C120  10nF_50V_0402  [FP-CC0402-MFG]
C121  0.1uF_25V_0402  [FP-0402-L_1_0_1-W_0_5_0_1-IPC_C]
C122  4.7uF_16V_0402  [FP-CL829-IPC_C]
C123  47pF_50V_0402  [CAPC1005X55X25LL05T10]
C124  47pF_50V_0402  [CAPC1005X55X25LL05T10]
C125  10nF_50V_0402  [FP-CC0402-MFG]
C126  0.1uF_25V_0402  [FP-0402-L_1_0_1-W_0_5_0_1-IPC_C]
C127  0.1uF_25V_0402  [FP-0402-L_1_0_1-W_0_5_0_1-IPC_C]
FB1  600ohm_1.3A_0603  [FP-BLM18-0_15-t0_8-IPC_A]
FB3  600ohm_1.3A_0603  [FP-BLM18-0_15-t0_8-IPC_A]
FB4  600ohm_1.3A_0603  [FP-BLM18-0_15-t0_8-IPC_A]
J2  105017-0001  [USB-MICRO-B_V]
R10  649_1%_0402  [RESC1005X40X25LL05T05]
R11  27_1%_0402  [RESC1005X40X25NL05T05]
R12  27_1%_0402  [RESC1005X40X25NL05T05]
R13  27_1%_0402  [RESC1005X40X25NL05T05]
R14  27_1%_0402  [RESC1005X40X25NL05T05]
R55  10K_1%_0402  [RESC1005X40X25LL05T10]
R57  0_5%_0402  [RESC1005X40X25NL05T10]
R59  0_5%_0402  [RESC1005X40X25NL05T10]
R60  15K_1%_0402  [FP-ERJ2R-MFG]
R61  0_5%_0402  [RESC1005X40X25NL05T10]
R62  27_1%_0402  [RESC1005X40X25NL05T05]
R63  27_1%_0402  [RESC1005X40X25NL05T05]
R64  27_1%_0402  [RESC1005X40X25NL05T05]
R65  27_1%_0402  [RESC1005X40X25NL05T05]
R66  10K_1%_0402  [RESC1005X40X25LL05T10]
R67  0_5%_0402  [RESC1005X40X25NL05T10]
R68  0_5%_0402  [RESC1005X40X25NL05T10]
R69  4.7K_1%_0402  [RESC1005X40X25NL10T10]
R70  15K_1%_0402  [FP-ERJ2R-MFG]
U2  CY7C65634-28LTXC  [CYP-LTX28_M]  (parts A,B of 2)
U3  FT231XQ-R  [FP-QFN-20-MFG]
U4  FT231XQ-R  [FP-QFN-20-MFG]
U13  TPD3E001DRYR  [DRY0006A]
Y2  ABM8G-12.000MHZ-18-D2Y-T  [FP-ABM8G-MFG]

### Nets
GND: C31.2 C32.2 C33.2 C34.2 C39.2 C43.2 C46.2 C47.2 C49.2 C50.2 C51.2 C52.2 C53.1 C105.2 C116.1 C117.2 C118.2 C119.2 C120.2 C121.2 C122.2 C123.1 C124.1 C125.2 C126.2 C127.2 J2.5(GND) J2.6(SHLD1) J2.7(SHLD2) J2.8(SHLD3) J2.9(SHLD4) J2.10(SHLD5) J2.11(SHLD6) R10.1 R60.1 R61.1 R70.1 U2.18(TEST/I2C_SCL) U2.22(SELFPWR) U2.26(PWR#/I2C_SDA) U2.29(GND) U3.3(GND) U3.13(GND) U3.21(GND) U4.3(GND) U4.13(GND) U4.21(GND) U13.3(GND) Y2.2(GND) Y2.4(GND)
P3V3: R69.1
VBUS_USB: C46.1 C50.1 C105.1 C120.1 FB1.1 FB3.1 FB4.1 J2.1(VBUS) U13.6(VCC)
RX_BOOTSEL: R59.2 ; off-sheet RX_BOOTSEL
RX_FTDI_USB_N: C116.2 R13.1 U2.6(DD-[2]) ; off-sheet RX_FTDI_USB_N
RX_FTDI_USB_P: C53.2 R14.1 U2.7(DD+[2]) ; off-sheet RX_FTDI_USB_P
RX_RST_N: R57.2 ; off-sheet RX_RST_N
RX_USART1_RX: R11.2 ; off-sheet RX_USART1_RX
RX_USART1_TX: R12.2 ; off-sheet RX_USART1_TX
TX_BOOTSEL: R68.2 ; off-sheet TX_BOOTSEL
TX_FTDI_USB_N: C124.2 R64.1 U2.3(DD-[1]) ; off-sheet TX_FTDI_USB_N
TX_FTDI_USB_P: C123.2 R65.1 U2.4(DD+[1]) ; off-sheet TX_FTDI_USB_P
TX_RST_N: R67.2 ; off-sheet TX_RST_N
TX_USART1_RX: R62.2 ; off-sheet TX_USART1_RX
TX_USART1_TX: R63.2 ; off-sheet TX_USART1_TX
U3_N: R13.2 U3.9(USBDM)
U3_P: R14.2 U3.8(USBDP)
U4_N: R64.2 U4.9(USBDM)
U4_P: R65.2 U4.8(USBDP)
USB0_D_N: J2.2(D-) U2.1(D-) U13.1(IO1) ; off-sheet USB0_D_N
USB0_D_P: J2.3(D+) U2.2(D+) U13.2(IO2) ; off-sheet USB0_D_P
NetC31_1: C31.1 C32.1 C33.1 C34.1 U2.5(VCC_A) U2.9(VCC_A) U2.14(VCC_A) U2.21(VCC_D) U2.28(VREG)
NetC39_1: C39.1 U2.11(XOUT) Y2.1
NetC43_1: C43.1 U2.10(XIN) Y2.3
NetC47_1: C47.1 C49.1 FB1.2 U2.27(VCC)
NetC51_1: C51.1 C52.1 FB3.2 R55.2 U3.12(VCC)
NetC117_1: C117.1 R55.1 R60.2 U3.11(~{RESET})
NetC118_1: C118.1 C119.1 U3.10(3V3OUT) U3.20(VCCIO)
NetC121_1: C121.1 C122.1 FB4.2 R66.2 U4.12(VCC)
NetC125_1: C125.1 R66.1 R70.2 U4.11(~{RESET})
NetC126_1: C126.1 C127.1 U4.10(3V3OUT) U4.20(VCCIO)
NetR10_2: R10.2 U2.8(RREF)
NetR11_1: R11.1 U3.17(TXD)
NetR12_1: R12.1 U3.1(RXD)
NetR57_1: R57.1 U3.15(CBUS0)
NetR59_1: R59.1 U3.14(CBUS1)
NetR61_2: R61.2 U3.7(CBUS2)
NetR62_1: R62.1 U4.17(TXD)
NetR63_1: R63.1 U4.1(RXD)
NetR67_1: R67.1 U4.15(CBUS0)
NetR68_1: R68.1 U4.14(CBUS1)
NetR69_2: R69.2 U4.7(CBUS2)

Not connected (* = marked no-connect by the designer): J2 4(ID); U2 12(NC) 13(NC) 15(NC) 16(NC) 17(RESET#) 19(NC) 20(NC) 23(GANG) 24(OVR#[2]) 25(OVR#[1]); U3 2(~{RI}) 4(~{DSR}) 5(~{DCD}) 6(~{CTS}) 16(CBUS3) 18(~{DTR}) 19(~{RTS}); U4 2(~{RI}) 4(~{DSR}) 5(~{DCD}) 6(~{CTS}) 16(CBUS3) 18(~{DTR}) 19(~{RTS}); U13 4(IO3) 5(NC)

### Layout directives
differential pair: RX_FTDI_USB_N, RX_FTDI_USB_P, TX_FTDI_USB_N, TX_FTDI_USB_P, U3_N, U3_P, U4_N, U4_P, USB0_D_N, USB0_D_P

### Notes on the sheet
- USB to UART
- CBUS2 = ID signal, 0 for RX, 1 for TX

### Library data of the parts
C31-C34 C47 C51 C118 C119 C121 C126 C127 = CMP-2008-02519-2: as C2 on sheet 01-Antennas; Package Quantity: 1; Capacitance: 100nF; Min Operating Temperature: -55°C; Voltage: 25V; Voltage Rating: 25V; Construction: Flat; Max Operating Temperature: 125°C; Radiation Hardening: No; Depth: 0.5mm; Thickness: 0.022inch; Voltage Rating (DC): 25V; Number of Pins: 2; Lead Free: Lead Free; Series: -; REACH SVHC: No SVHC; Length: 1mm; Dielectric: X7R; RoHS Compliant: Yes; Mount: Surface Mount; Packaging: Tape and Reel; Case/Package: 0402; Case Code (Imperial): 0402; Termination: SMD/SMT; Width: 0.02inch; Case Code (Metric): 1005; Tolerance: 10%
C39 C43 = CMP-08246-002674-1: CAP CER 10PF 50V C0G 0402; Temperature Coefficient: 30ppm/°C; Dielectric Material: Ceramic; Termination: SMD/SMT; Width: 0.02inch; Case Code (Metric): 1005; Thickness: 0.022inch; Height: 0.5mm; REACH SVHC: No SVHC; Case Code (Imperial): 0402; Voltage: 50V; Capacitance: 10pF; Max Operating Temperature: 125°C; Length: 1mm; Construction: Flat; Packaging: Tape and Reel; Lead Free: Lead Free; Series: C; Depth: 0.5mm; Dielectric: C0G; Package Quantity: 1; Mount: Surface Mount; Voltage Rating (DC): 50V; Voltage Rating: 50V; Case/Package: 0402; RoHS Compliant: Yes; Min Operating Temperature: -55°C; Number of Pins: 2; Radiation Hardening: No; Weight: 2.3E-05oz
C46 C50 C117 C120 C125 = CMP-2100-03592-2: CAP CER 10000PF 50V X7R 0402; Manufacturer Part Number: CC0402KRX7R9BB103; Manufacturer: YAGEO; Temperature Coefficient: 30ppm/°C; Capacitance: 10 nF; Material: Ceramic; Automotive Grade: NA; Tolerance: 0.1; Value: 10 nF; Device Class L3: Ceramic Capacitors; Temperature: -55°C to +125°C; Footprint Url: http://www.yageo.com/exep/pages/download/literatures/UPY-C_GEN_24.pdf; Ipc Land Pattern Name: CAPC10050X50; Device Class L1: Passive Components; Automotive: No; Octopart: https://octopart.com/cc0402krx7r9bb103-yageo-8376513; Lead Free: Yes; Temperature Range Low: -55°C; Height: 0.55mm; ComponentLink2URL: http://www.yageo.com/documents/recent/UPY-GP_NP0_16V-to-50V_16.pdf; Category: Cap; ComponentLink2Description: Datasheet; Temperature Range High: +125°C; Digikey Description: CAP CER 10000PF 50V X7R 0402; Voltage Rating: 50 V; Package: CC0402; Device Class L2: Capacitors; Mouser Description: 0402 10 nF 50 V ±10 % Tolerance X7R SMT Multilayer Ceramic Capacitor; RoHS: TRUE; Temperature Characteristic: X7R
C49 C52 C122 = CMP-13271-001468-1: Cap Ceramic 4.7uF 16V X5R ±20% SMD 0402 +85°C Paper T/R; Mount: Surface Mount; Case Code (Metric): 1005; Case/Package: 0402; Length: 0.039inch; Capacitance: 4.7uF; Voltage Rating: 16V; Max Operating Temperature: 85°C; Tolerance: 20%; Thickness: 0.022inch; Min Operating Temperature: -55°C; Case Code (Imperial): 0402; Packaging: Tape and Reel; Width: 0.02inch
C53 C116 C123 C124 = CMP-2008-04368-1: Part Number: GRM1555C1H470JA01D; Manufacturer: Murata
C105 = CMP-2000-06226-4: Multilayer Ceramic Capacitor 10uF 16V X5R 20% SMD 0603 T/R; Packaging: Tape and Reel; Construction: Flat; Height: 0.8mm; Max Operating Temperature: 85°C; Dielectric: X5R; Case Code (Metric): 1608; Voltage Rating (DC): 16V; Width: 0.031inch; Voltage Rating: 16V; Length: 0.063inch; RoHS Compliant: Yes; Halogen Free: Halogen Free; Case Code (Imperial): 0603; Capacitance: 10uF; Mount: Surface Mount; Thickness: 0.031inch; Tolerance: 20%; Min Operating Temperature: -55°C; Series: M; Termination: SMD/SMT; Case/Package: 0603; Package Quantity: 1
FB1 FB3 FB4 = CMP-0686-00581-3: Chip Ferrite Bead, 0603, 600Ω @ 100MHz, 0.15Ω, 25%, 1.3A; Material: Steel; Number of Lines: 1; Impedance: 600R; DC Resistance (DCR): 150mR; Tolerance: 25%; Case Code (Metric): 1608; Width: 0.8mm; DC Current: 1.3A; Max DC Current: 1.3A; Package Quantity: 1; Number of Pins: 2; Military Standard: Not; RoHS Compliant: Yes; Termination: SMD/SMT; Max Operating Temperature: 125°C; Length: 1.6mm; Depth: 0.8mm; Case Code (Imperial): 0603; Series: BLM18K; Inductor Type: FERRITE BEAD; Core Material: Ferrite; Number of Circuits: 1; Height: 0.8mm; Case/Package: 0603; REACH SVHC: No SVHC; Packaging: Tape and Reel; Min Operating Temperature: -55°C; Max Current Rating: 1.3A; Radiation Hardening: No; Current Rating: 1.3A; Lead Free: Lead Free; Test Frequency: 100MHz; Weight: 7.1E-05oz
J2 = CMP-2000-05827-1: Micro-USB B Receptacle, Right Angle, Bottom Mount, Surface Mount, with Solder Tabs, -30 to 85 degC, 5-Pin USB, RoHS, Tape and Reel; Manufacturer: Molex; Featured Product: Micro-USBConnectorsUSBConnectors; Other Names: WM1399DKR; Package Version: Rev. F, 12/2012; Number of Contacts: 5; Connector Type: USB-microB; Catalog Drawings: 1050170001; 3D Model: 105017-0001.stp; Mating Products: WM17145-ND-CABLEMICROUSBBTOSTDA1.0MWM17147-ND-CABLEMICROUSBBTOSTDA2.0MWM17146-ND-CABLEMICROUSBBTOSTDA1.5M; PCN Assembly/Origin: ResinSupplier21/Oct/2015; Voltage - Max: 30V; Online Catalog: Molex-MicroUSB; Manufacturer URL: http://www.molex.com/; Package Description: 5-Leads USB, Micro B, Body 7.5 x 5 mm, Pitch 0.65 mm; Datasheet URL: http://www.molex.com/elqNow/elqRedir.htm?ref=http://www.molex.com/webdocs/datasheets/pdf/en-us/1050170001_IO_CONNECTORS.pdf; Ingress Protection: -; Datasheet Version: 03/2016; Mounting Type: BoardCutout,SurfaceMount,RightAngle; Circuits: 5; Standard Package: 1; Package Reference: MICRO-B; Package URL: http://www.molex.com/pdm_docs/sd/1050170001_sd.pdf; Category: Connectors,Interconnects; Series: -; RoHS Information: 1050170001CertofCompliance; Features: Shielded,SolderRetention; Family: USB,DVI,HDMIConnectors; Specifications: -; Gender: Receptacle; Packaging: Digi-Reel®; Mounting Technology: SurfaceMount
R10 = CMP-2002-01027-1: Part Number: ERJ-2RKF6490X; Manufacturer: Panasonic
R11-R14 R62-R65 = CMP-2002-08434-1: Part Number: CRCW040227R0FKED; Manufacturer: Vishay Dale
R55 R66 = CMP-2002-07353-1: Part Number: RC0402FR-0710KL; Manufacturer: Yageo / Phycomp
R57 R59 R61 R67 R68 = CMP-2002-06457-1: as R1 on sheet 01-Antennas
R60 R70 = CMP-2002-00694-4: RES SMD 15K OHM 1% 1/10W 0402; Manufacturer Part Number: ERJ-2RKF1502X; Manufacturer: Panasonic; Automotive Grade: Grade 0; Voltage Rating: 50V; Resistance: 15kΩ; Temperature Coefficient: 100ppm/°C; Power Rating: 0.1W; Value: 15kΩ; ComponentLink2URL: https://industrial.panasonic.com/cdbs/www-data/pdf/RDA0000/AOA0000C304.pdf; Automotive: Yes; Temperature: -55°C to +155°C; Height: 0.4mm; Digikey Description: RES SMD 15K OHM 1% 1/10W 0402; Category: Res; Device Class L2: Resistors; Device Class L1: Passive Components; Package: ERJ2R; Temperature Range Low: -55°C; Tolerance: 1%; Series: ERJ; Footprint Url: https://b2b-api.panasonic.eu/file_stream/pids/fileversion/1180; Mouser Description: Res Thick Film 1.0 x 0.5 mm 15K Ohm 1% 0.1W(1/10W) 100ppm/ C Molded SMD Punched Carrier T/R; Composition: Thick Film; Lead Free: Yes; Device Class L3: Chip SMD Resistors; Octopart: https://octopart.com/erj-2rkf1502x-panasonic-55404985; RoHS: TRUE; Temperature Range High: +155°C; ComponentLink2Description: Datasheet
R69 = CMP-2002-05217-1: as R18 on sheet 02-8A34004_DPLL-1
U2 = CMP-0967-00085-1: HX2VL(TM) Very Low Power USB 2.0 Hub Controller, 2 Hub Ports, 0 to 70 degC, 28-Pin QFN (LTX28), Bulk; Manufacturer: Cypress; No. of Hub Ports: 2; Max. Operating Voltage (V): 5.25; Single/Multi TT: Single; Min. Operating Voltage (V): 3.15; PackageVersion: Rev. **, 10/2010; ComponentLink1Description: Manufacturer URL; Max. Operating Temp. (degreesC): 70; ComponentLink2URL: http://www.cypress.com/?docID=39996; Mounting Technology: Surface Mount; ComponentLink3Description: Package Specification; PackageDescription: 28-Pin Quad Flat No-Lead Package, Body 5 x 5 mm, Pitch 0.5 mm; DatasheetVersion: Rev. *F; RoHS: Pb-Free; Min. Operating Temp. (degreesC): 0; ComponentLink2Description: Datasheet; PackageReference: LTX28; ComponentLink1URL: http://www.cypress.com/; PartNumber: CY7C65634-28LTXC; Packing: Bulk; ComponentLink3URL: http://www.cypress.com/?docID=33735; Code_JEDEC: MO-220
U3 U4 = CMP-0248-00001-3: IC USB SERIAL FULL UART 20QFN; Data Rate: 12Mbps; Operating Supply Current: 8mA; Min Supply Voltage: 2.97V; Max Supply Voltage: 5.5V; Number of Channels: 1; Min Operating Temperature: -40°C; Case/Package: QFN; Mount: Surface Mount; Number of Pins: 20; Interface: UART; Lead Free: Lead Free; Package Quantity: 5000; Weight: 0.004339oz; Packaging: Tape and Reel; Max Operating Temperature: 85°C
U13 = CMP-0326-00032-3: Low-Capacitance + / - 15 kV ESD-Protection Array for High-Speed Data Interfaces, 3 Channels, -40 to +85 degC, 6-pin SON (DRY), Green (RoHS & no Sb/Br); Manufacturer: Texas Instruments; USB High Speed: TRUE; SubFamily: ESD Solution; IO Capacitance(Typ)(pF): 1.5; IEC 61000-4-2 Contact(+/- kV): 8; IO Leakage Current(nA): Jan-00; Breakdown Voltage(Min)(V): 11; IEC 61000-4-2 Air-Gap(+/- kV): 15; DatasheetVersion: SLLS683D; Mounting Technology: Surface Mount; ComponentLink1URL: http://www.ti.com/; PackageReference: DRY0006A; ComponentLink2URL: http://www.ti.com/general/docs/lit/getliterature.tsp?genericPartNumber=TPD3E001&fileType=pdf; ComponentLink2Description: Datasheet; ComponentLink3Description: URL Link1; PackageDescription: 6-Pin Plastic Small Outline No-Lead, 1 x 1.45 x 0.6 mm Body, 0.5 mm Pitch; ComponentLink1Description: Manufacturer URL; PackageVersion: revF, Dec-2011; PartNumber: TPD3E001DRYR; Eco-Plan: Green (RoHS & no Sb/Br); ComponentLink3URL: SamplesURL:http://www.ti.com/product/tpd3e001#samples
Y2 = CMP-2000-05039-3: Crystal 12MHz ±20ppm (Tol) ±30ppm (Stability) 18pF FUND 120Ω 4-Pin SMD T/R; Series Resistance: 120R; Max Operating Temperature: 85°C; Mount: Surface Mount; Width: 2.5mm; Series: ABM8G; Termination: SMD/SMT; Frequency Tolerance: 20ppm; Tolerance: 20ppm; Min Operating Temperature: -40°C; Operating Frequency: 12 MHz; Depth: 2.5mm; Load Capacitance: 18pF; Number of Pins: 4; Length: 3.2mm; Radiation Hardening: No; Frequency Stability: 30ppm; Height: 1mm; Packaging: Tape and Reel; Package Quantity: 1000; ESR (Equivalent Series Resistance): 120R; Lead Free: Lead Free; Frequency: 12MHz; Case/Package: CSMD